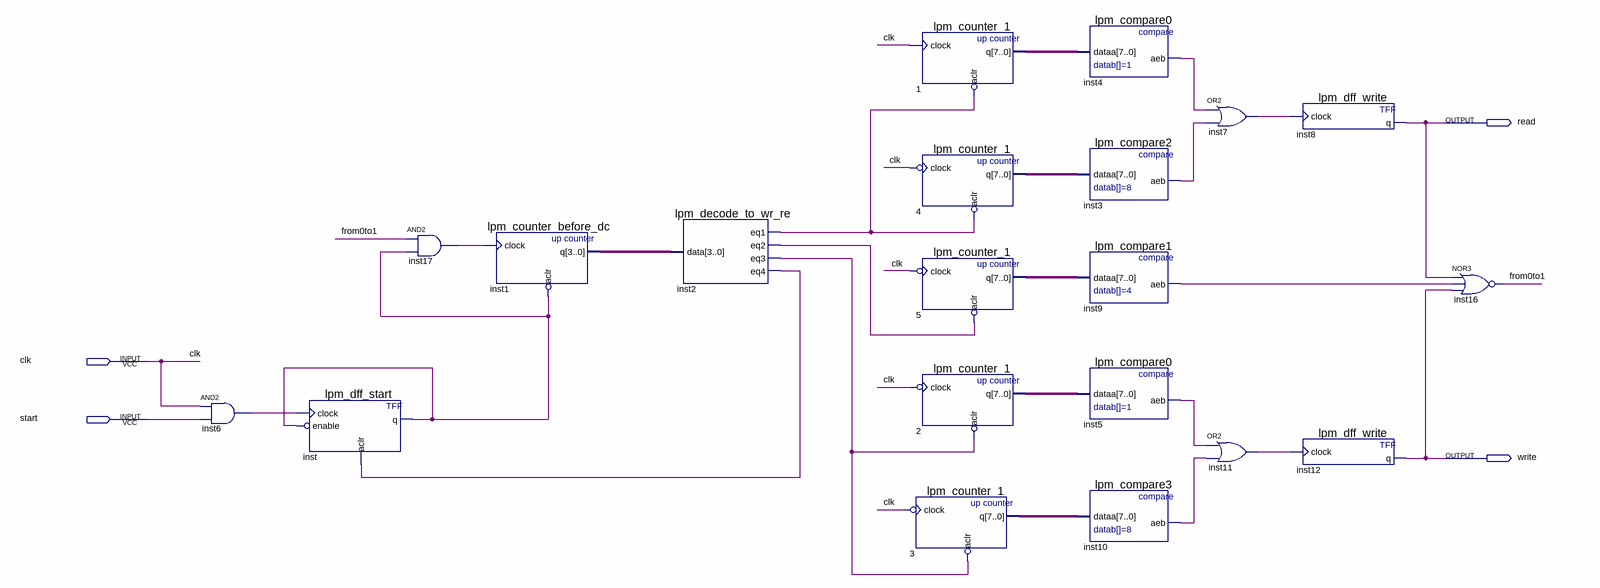
[diagram p0: schematic sheet]
// Quartus schematic start_pin.bdf as structural Verilog: 20 symbols, 4 pins
module start_pin (
  input  clk,
  input  start,
  output read,
  output write
);

  wire from0to1, inst2_eq1, inst2_eq2, inst2_eq3, inst2_eq4, inst3_aeb, inst4_aeb, inst5_aeb, inst6_out,
       inst7_out, inst9_aeb, inst10_aeb, inst11_out, inst17_out, inst_q;
  wire [3:0] inst1_q;
  wire [7:0] n1_q, n2_q, n3_q, n4_q, n5_q;

  and inst6 (inst6_out, clk, start);
  lpm_dff_start inst (.clock(inst6_out), .enable(~inst_q), .aclr(inst2_eq4), .q(inst_q));
  and inst17 (inst17_out, from0to1, inst_q);
  lpm_counter_before_dc inst1 (.clock(inst17_out), .aclr(~inst_q), .q(inst1_q));
  lpm_decode_to_wr_re inst2 (.data(inst1_q), .eq1(inst2_eq1), .eq2(inst2_eq2), .eq3(inst2_eq3), .eq4(inst2_eq4));
  lpm_counter_1 u_1 (.clock(clk), .aclr(~inst2_eq1), .q(n1_q));
  lpm_counter_1 u_4 (.clock(~clk), .aclr(~inst2_eq1), .q(n4_q));
  lpm_counter_1 u_5 (.clock(~clk), .aclr(~inst2_eq2), .q(n5_q));
  lpm_counter_1 u_2 (.clock(~clk), .aclr(~inst2_eq3), .q(n2_q));
  lpm_counter_1 u_3 (.clock(~clk), .aclr(~inst2_eq3), .q(n3_q));
  lpm_compare0 inst4 (.dataa(n1_q), .aeb(inst4_aeb));
  lpm_compare2 inst3 (.dataa(n4_q), .aeb(inst3_aeb));
  lpm_compare1 inst9 (.dataa(n5_q), .aeb(inst9_aeb));
  lpm_compare0 inst5 (.dataa(n2_q), .aeb(inst5_aeb));
  lpm_compare3 inst10 (.dataa(n3_q), .aeb(inst10_aeb));
  or inst7 (inst7_out, inst4_aeb, inst3_aeb);
  or inst11 (inst11_out, inst5_aeb, inst10_aeb);
  lpm_dff_write inst8 (.clock(inst7_out), .q(read));
  lpm_dff_write inst12 (.clock(inst11_out), .q(write));
  nor inst16 (from0to1, read, inst9_aeb, write);
endmodule
